# Altium schematic sheet ETH.SchDoc
size A2
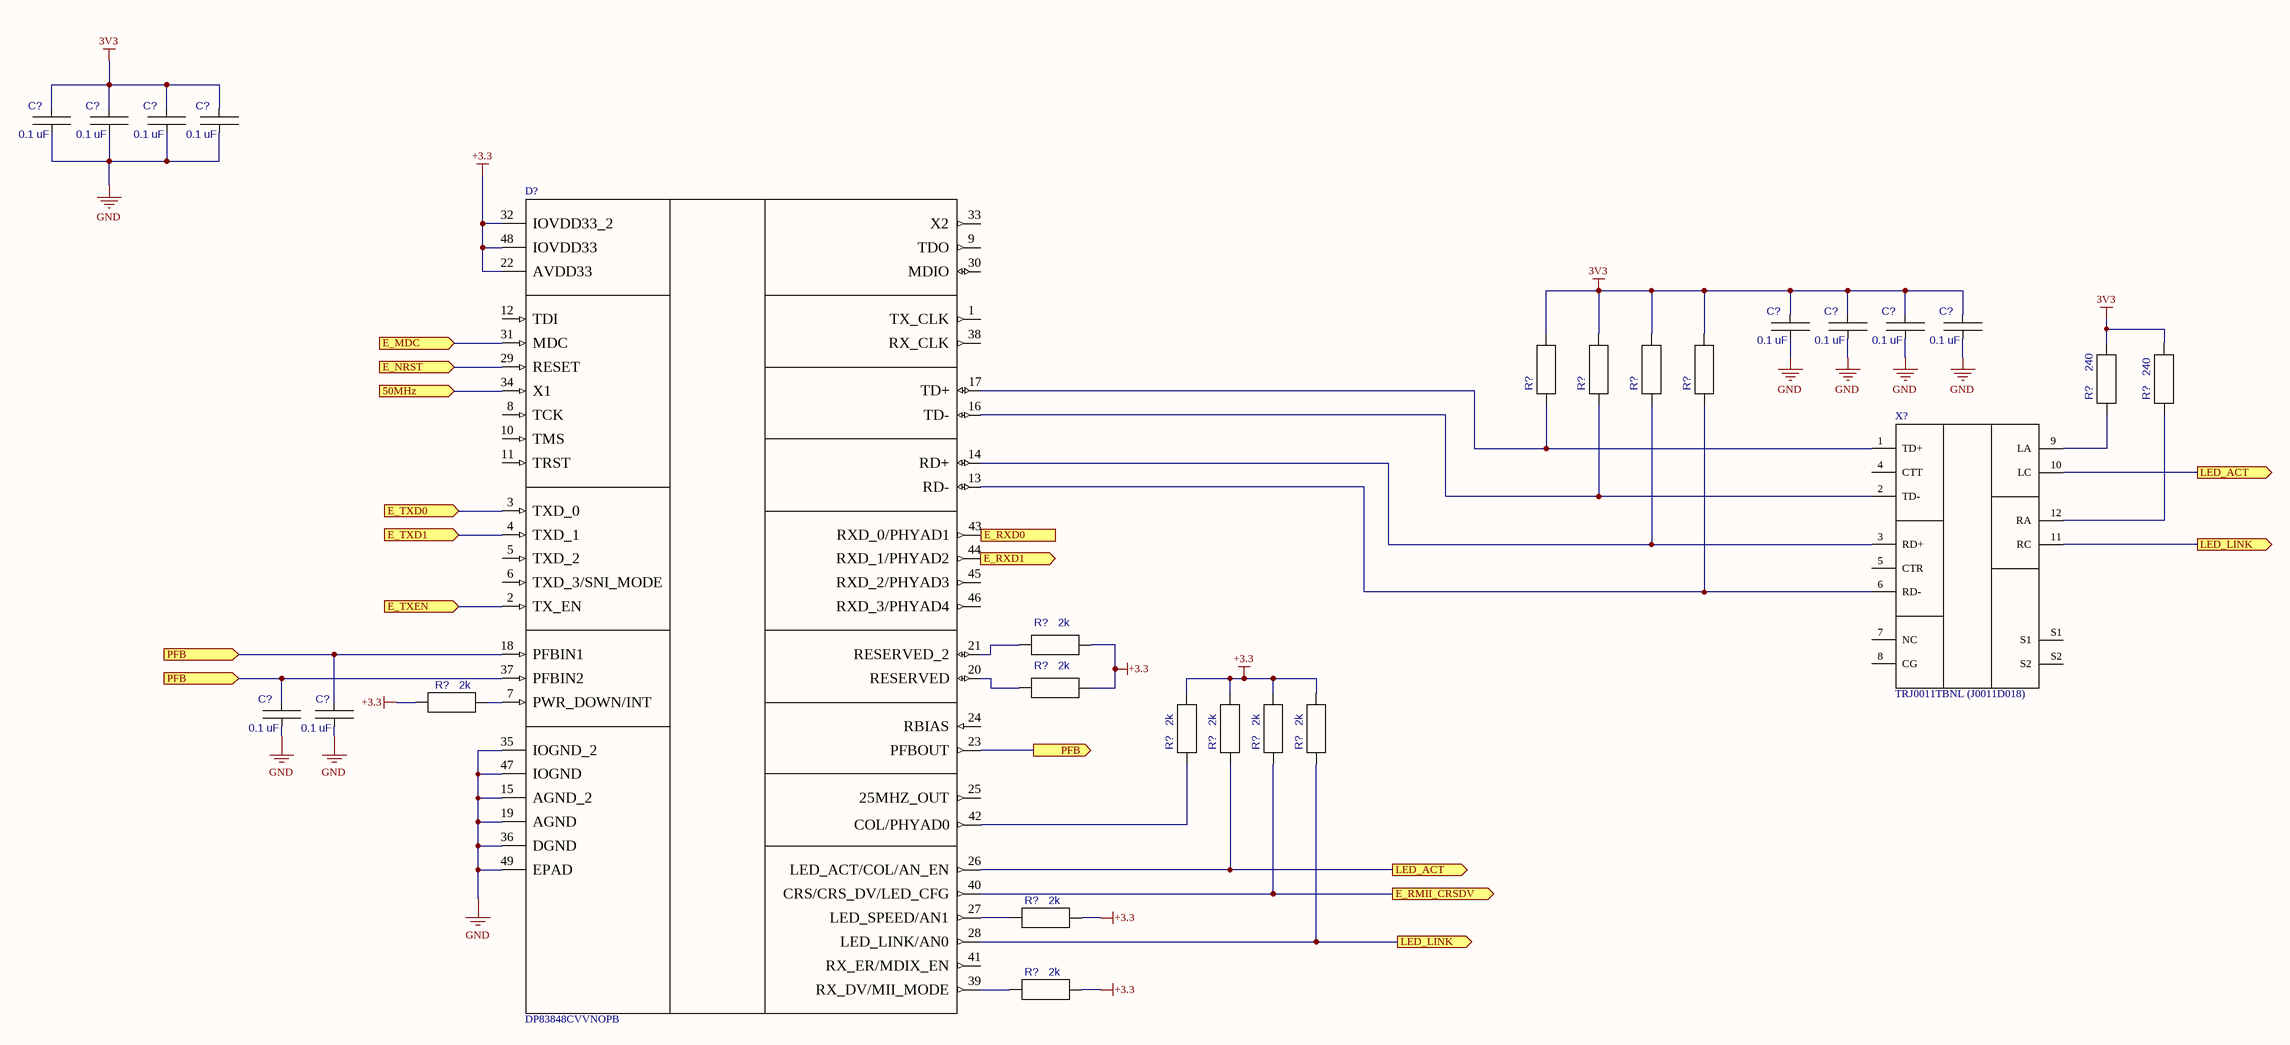
[diagram p0: ETH.SchDoc]

## Parts
(Parts that share a designator on the sheet are numbered #1, #2 ... from top to bottom, then left to right.)
C?#1  0.1 uF  [CAP_0805]
C?#2  0.1 uF  [CAP_0805]
C?#3  0.1 uF  [CAP_0805]
C?#4  0.1 uF  [CAP_0805]
C?#5  0.1 uF  [CAP_0805]
C?#6  0.1 uF  [CAP_0805]
C?#7  0.1 uF  [CAP_0805]
C?#8  0.1 uF  [CAP_0805]
C?#9  0.1 uF  [CAP_0805]
C?#10  0.1 uF  [CAP_0805]
D?  DP83848CVVNOPB  [QFP48]
R?#1  RES_0805  [RES_0805]  (value not drawn)
R?#2  RES_0805  [RES_0805]  (value not drawn)
R?#3  RES_0805  [RES_0805]  (value not drawn)
R?#4  RES_0805  [RES_0805]  (value not drawn)
R?#5  240  [RES_0805]
R?#6  240  [RES_0805]
R?#7  2k  [RES_0805]
R?#8  2k  [RES_0805]
R?#9  2k  [RES_0805]
R?#10  2k  [RES_0805]
R?#11  2k  [RES_0805]
R?#12  2k  [RES_0805]
R?#13  2k  [RES_0805]
R?#14  2k  [RES_0805]
R?#15  2k  [RES_0805]
X?  TRJ0011TBNL (J0011D018)  [J0011D018]

## Ports
50MHz (in), E_MDC (in), E_NRST (in), E_RMII_CRSDV (out), E_RXD0 (out), E_RXD1 (out), E_TXD0 (in), E_TXD1 (in), E_TXEN (in), LED_ACT (out), LED_LINK (out), PFB (in), PFB (out)

## Nets
3V3: C?#1.1 C?#2.1 C?#3.1 C?#4.1 C?#5.1 C?#6.1 C?#7.1 C?#8.1 R?#1.1 R?#2.1 R?#3.1 R?#4.1 R?#5.1 R?#6.1
+3.3: D?.22(AVDD33) D?.32(IOVDD33_2) D?.48(IOVDD33) R?#7.1 R?#8.1 R?#9.2 R?#10.1 R?#11.1 R?#12.1 R?#13.1 R?#14.1 R?#15.1
GND: C?#1.2 C?#2.2 C?#3.2 C?#4.2 C?#5.2 C?#6.2 C?#7.2 C?#8.2 C?#9.2 C?#10.2 D?.15(AGND_2) D?.19(AGND) D?.35(IOGND_2) D?.36(DGND) D?.47(IOGND) D?.49(EPAD)
50MHz: D?.34(X1) ; port 50MHz
E_MDC: D?.31(MDC) ; port E_MDC
E_NRST: D?.29(RESET) ; port E_NRST
E_RMII_CRSDV: D?.40(CRS/CRS_DV/LED_CFG) R?#12.2 ; port E_RMII_CRSDV
E_RXD0: D?.43(RXD_0/PHYAD1) ; port E_RXD0
E_RXD1: D?.44(RXD_1/PHYAD2) ; port E_RXD1
E_TXD0: D?.3(TXD_0) ; port E_TXD0
E_TXD1: D?.4(TXD_1) ; port E_TXD1
E_TXEN: D?.2(TX_EN) ; port E_TXEN
LED_ACT: D?.26(LED_ACT/COL/AN_EN) R?#11.2 X?.10(LC) ; port LED_ACT
LED_LINK: D?.28(LED_LINK/AN0) R?#13.2 X?.11(RC) ; port LED_LINK
PFB: C?#9.1 C?#10.1 D?.18(PFBIN1) D?.23(PFBOUT) D?.37(PFBIN2) ; port PFB
NetD?_7: D?.7(PWR_DOWN/INT) R?#9.1
NetD?_13: D?.13(RD-) R?#4.2 X?.6(RD-)
NetD?_14: D?.14(RD+) R?#3.2 X?.3(RD+)
NetD?_16: D?.16(TD-) R?#2.2 X?.2(TD-)
NetD?_17: D?.17(TD+) R?#1.2 X?.1(TD+)
NetD?_20: D?.20(RESERVED) R?#8.2
NetD?_21: D?.21(RESERVED_2) R?#7.2
NetD?_27: D?.27(LED_SPEED/AN1) R?#14.2
NetD?_39: D?.39(RX_DV/MII_MODE) R?#15.2
NetD?_42: D?.42(COL/PHYAD0) R?#10.2
NetR?#5_2: R?#5.2 X?.9(LA)
NetR?#6_2: R?#6.2 X?.12(RA)

Not connected (* = marked no-connect by the designer): D? 1(TX_CLK) 5(TXD_2) 6(TXD_3/SNI_MODE) 8(TCK) 9(TDO) 10(TMS) 11(TRST) 12(TDI) 24(RBIAS) 25(25MHZ_OUT) 30(MDIO) 33(X2) 38(RX_CLK) 41(RX_ER/MDIX_EN) 45(RXD_2/PHYAD3) 46(RXD_3/PHYAD4); X? 4(CTT) 5(CTR) 7(NC) 8(CG) S1 S2

## Library data of the parts
C?#1-C?#10 = CAP_0805: Value: *
D? = DP83848CVVNOPB: ETH Transciever
R?#5-R?#15 = RES_0805: Value: *
X? = RJ45 J0011D018: Conn RJ-45 F 8 POS 2.54mm Solder RA Thru-Hole 12 Terminal 1 Port Cat 5/Cat 6
R?#1-R?#4 = RES_0805: Value: *